# EAGLE design oldSHSDHDTD_system[1] (EAGLE 9.6.2)
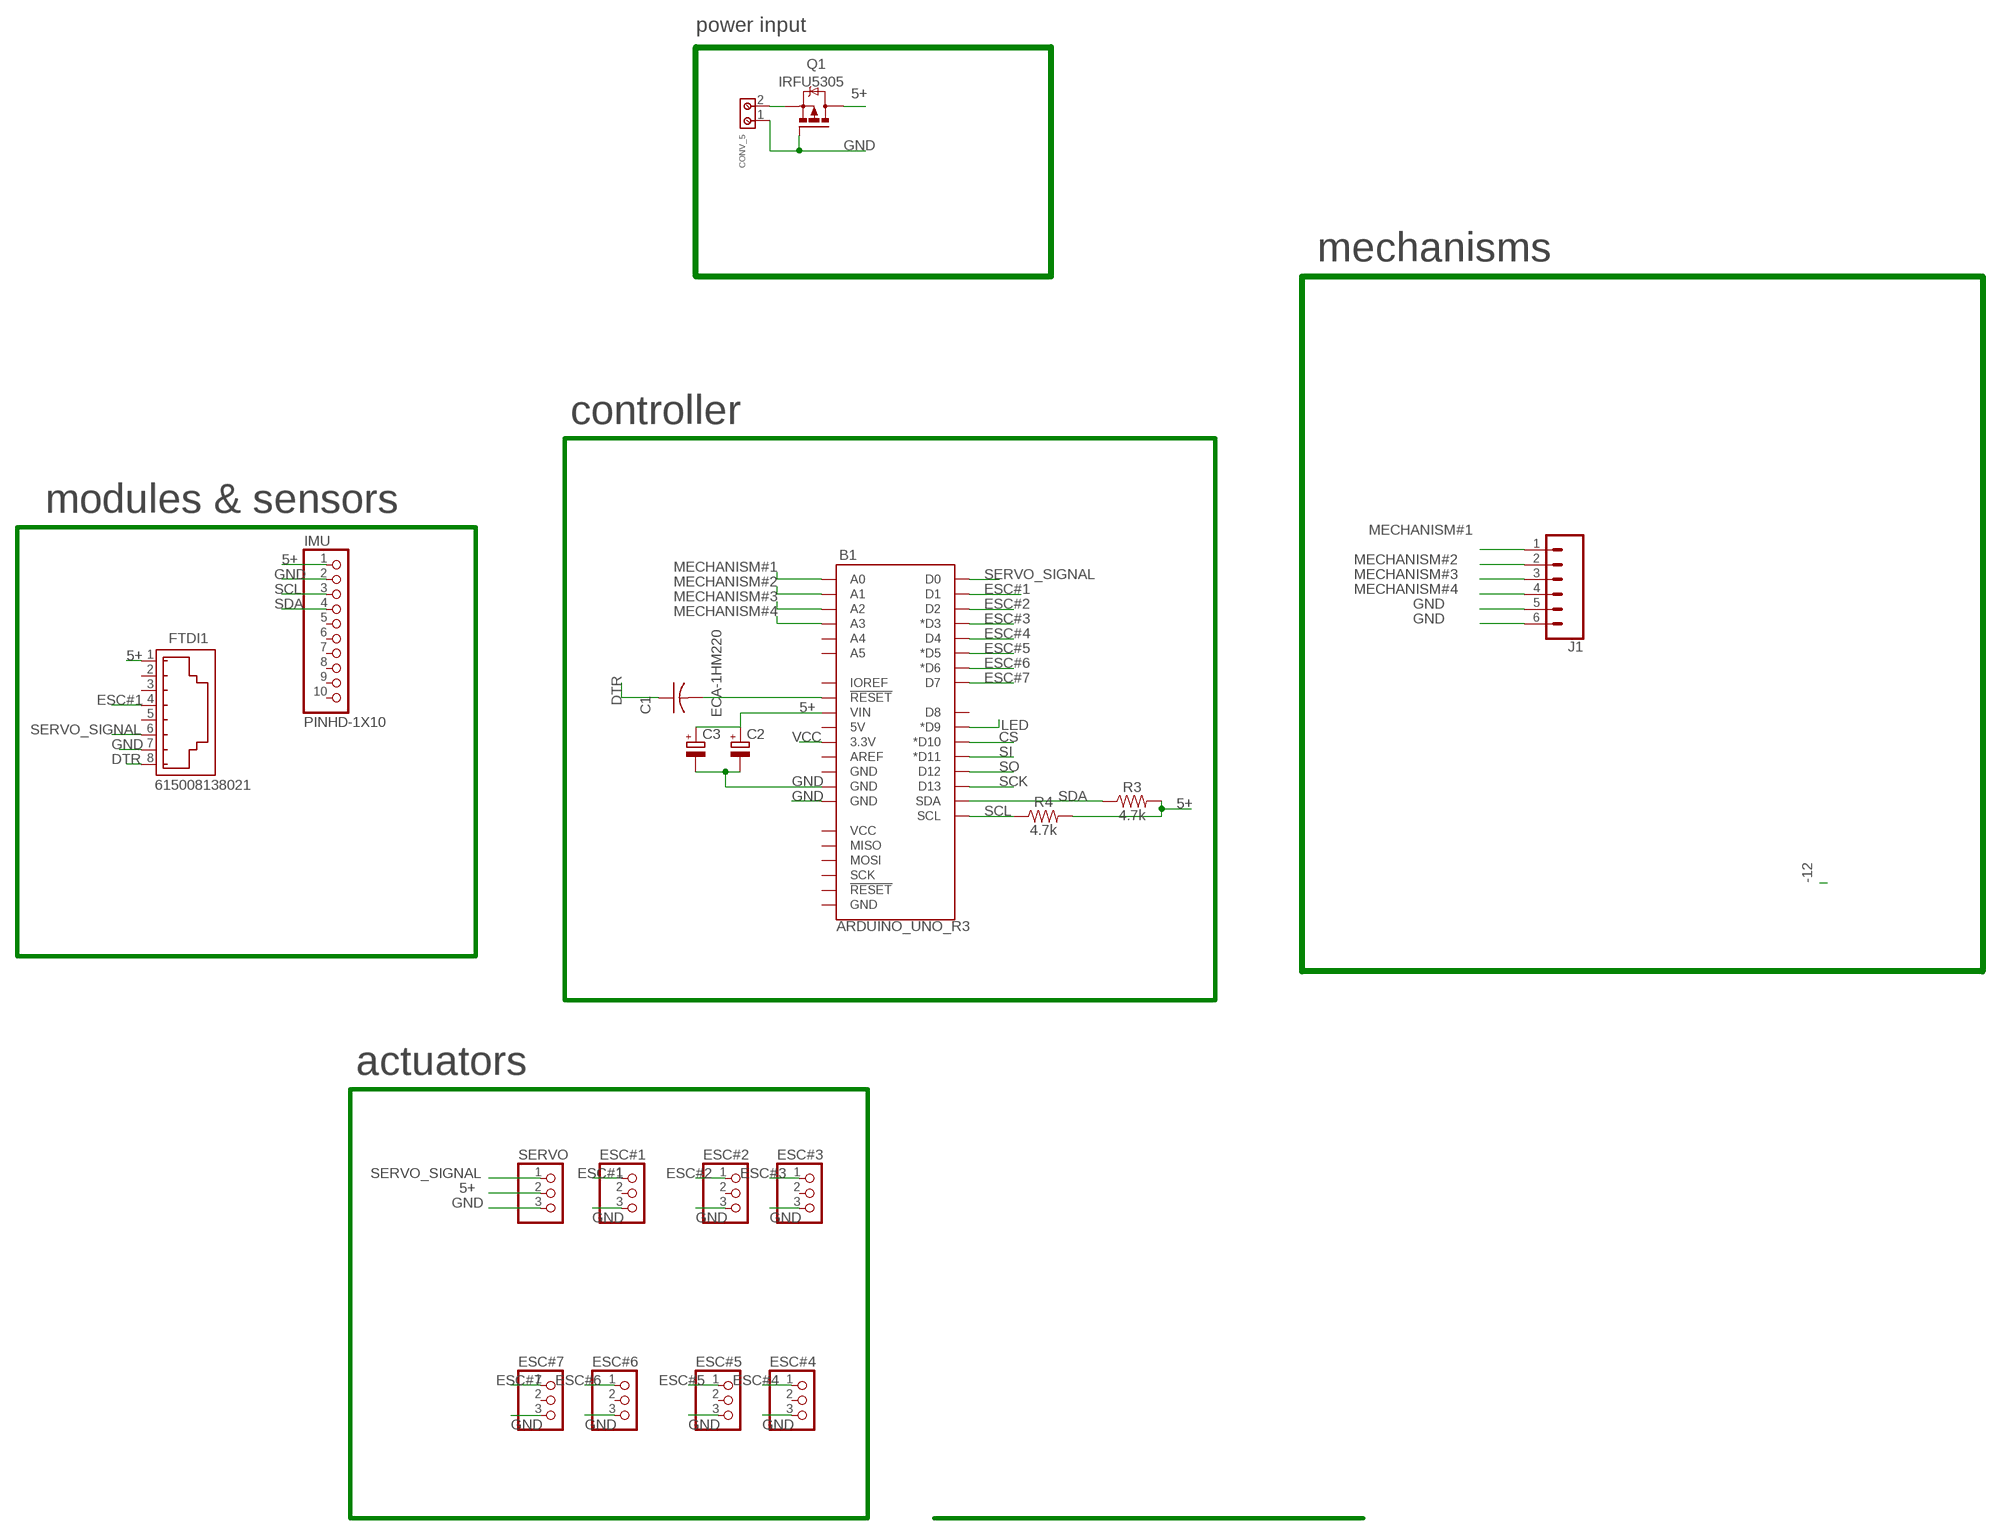
[diagram p0: schematic, sheet 1]

## Parts
B1  ARDUINO_UNO_R3  [ARDUINO_R3]
C1  ECA-1HM220  [CAP_RADIAL_2MM]
C2  CPOL-EUE7.5-16  [E7,5-16]
C3  CPOL-EUE7.5-16  [E7,5-16]
CONV_5  691213500002  [691213500002]
ESC#1  PINHD-1X3  [1X03]
ESC#2  PINHD-1X3  [1X03]
ESC#3  PINHD-1X3  [1X03]
ESC#4  PINHD-1X3  [1X03]
ESC#5  PINHD-1X3  [1X03]
ESC#6  PINHD-1X3  [1X03]
ESC#7  PINHD-1X3  [1X03]
FTDI1  615008138021  [615008138021]
IMU  PINHD-1X10  [1X10-BIG]
J1  CONN_06LOCK_LONGPADS  [1X06_LOCK_LONGPADS]
Q1  IRFU5305  [I-PAK_TO251AA]
R3  4.7k  10MOHM-HORIZ-1/4W-5%  [AXIAL-0.3]
R4  4.7k  10MOHM-HORIZ-1/4W-5%  [AXIAL-0.3]
SERVO  PINHD-1X3  [1X03]

## Nets
5+: B1.VIN C2.+ C3.+ FTDI1.1 IMU.1 Q1.2(D) R3.P$2 R4.P$2 SERVO.2
CS: B1.D10(*D10)
DTR: C1.1 FTDI1.8
ESC#1: B1.D1 ESC#1.1 FTDI1.4
ESC#2: B1.D2 ESC#2.1
ESC#3: B1.D3(*D3) ESC#3.1
ESC#4: B1.D4 ESC#4.1
ESC#5: B1.D5(*D5) ESC#5.1
ESC#6: B1.D6(*D6) ESC#6.1
ESC#7: B1.D7 ESC#7.1
GND: B1.GND@2(GND) B1.GND@3(GND) C2.- C3.- CONV_5.1 ESC#1.3 ESC#2.3 ESC#3.3 ESC#4.3 ESC#5.3 ESC#6.3 ESC#7.3 FTDI1.7 IMU.2 J1.5 J1.6 Q1.1(G) SERVO.3
LED: B1.D9(*D9)
MECHANISM#1: B1.A0 J1.1
MECHANISM#2: B1.A1 J1.2
MECHANISM#3: B1.A2 J1.3
MECHANISM#4: B1.A3 J1.4
N$2: B1.RESET@1(!RESET!) C1.2
N$3: CONV_5.2 Q1.3(S)
SCK: B1.D13
SCL: B1.SCL IMU.3 R4.P$1
SDA: B1.SDA IMU.4 R3.P$1
SERVO_SIGNAL: B1.D0 FTDI1.6 SERVO.1
SI: B1.D11(*D11)
SO: B1.D12
VCC: B1.3.3V
Unconnected: B1.5V B1.A4 B1.A5 B1.AREF B1.D8 B1.GND@1(GND) B1.GND@4(GND) B1.IOREF B1.MISO B1.MOSI B1.RESET@2(!RESET!) B1.SCK B1.VCC ESC#1.2 ESC#2.2 ESC#3.2 ESC#4.2 ESC#5.2 ESC#6.2 ESC#7.2 FTDI1.2 FTDI1.3 FTDI1.5 IMU.5 IMU.6 IMU.7 IMU.8 IMU.9 IMU.10

## Notes on the sheet
- power input
- mechanisms
- controller
- modules & sensors
- actuators

## Library data of the parts
B1 = SparkFun-Boards:ARDUINO_UNO_R3: Arduino R3 Footprint with SPI header Arduino Uno R3 Compatible Footprint. Matches PCB size of the original board. SparkFun Products: SAMD21 Dev Breakout <https://www.sparkfun.com/products/13672> RedBoard <https://www.sparkfun.com/products/12757> R3 Stackable Headers <https://www.sparkfun.com/products/11417>
C1 = Resistor_Capacitor:ECA-1HM220: CAP ALUM 22UF 20% 50V RADIAL Manufacturer's datasheet <https://media.digikey.com/pdf/Data%20Sheets/Panasonic%20Electronic%20Components/ECA-xxM%20Series,TypeA.pdf>; CREATED_BY: PCBLayout.com; DIGIKEY_PART_NUMBER: P5179-ND; MANUFACTURER: Panasonic Electronic Components; MPN: ECA-1HM220; PACKAGE: CAP RADIAL 2MM LS
C2 C3 = rcl:CPOL-EU: POLARIZED CAPACITOR, European symbol; SPICEPREFIX: C
CONV_5 = Wurth_Connectors_WR-TBL Rising Cage Clamp:691213500002: WR-TBL Serie 2135 - 5.08 mm Vertical Entry Modular w. Rising Cage Clamp KIND PROPERTIES Pitch 5.08 mm MATERIAL PROPERTIES Insulator Material PA66 Insulator Flammability Rating UL94 V-0 Contact Material Copper Alloy Contact Plating Tin over Nickel Terminal Screw Material Steel Terminal Screw Plating Zinc Wire Guard Material Copper Alloy GENERAL INFORMATION Operating Temperature -30 up to +120 °C Compliance RoHS ELECTRICAL PROPERTIES IR cULus 14 A IR VDE 14 A Working Voltage [cULus] 300 V (AC) Working Voltage [VDE] 250 V (AC) Withstanding Voltage [UL] 1600 V (AC) Withstanding Voltage [cULus] 1600 Withstanding Voltage [VDE] 2000 Contact Resistance [cULus] 20 mΩ Contact Resistance [VDE] 20 mΩ MECHANICAL PROPERTIES Wire Strip Length 6 Screw M3 CERTIFICATION cULus Approval E150931 VDE Approval 40021366 PACKAGING PROPERTIES Packaging Box <https://www.we-online.com/catalog/media/o58403v209%20Family_WR-TBL_5_08_2135_VERTICAL_CABLE_ENTRY_W_RISING_CLAMP_6912135000XX.jpg> Details see: https://www.we-online.com/catalog/en/TBL_5_08_2135_VERTICAL_CABLE_ENTRY_W_RISING_CLAMP_6912135000XX/ Updated by Ella Wu 2019-11-26 2019(C) Wurth Elektronik; IR-UL: 14A; IR-VDE: 14A; PART-NUMBER: 691213500002; PINS: 2; PITCH: 5.08mm; TYPE: Vertical; WIRE: 14 to 30 (AWG) 2.08 to 0.0509 (mm²); WORKING-VOLTAGE-UL: 300V (AC); WORKING-VOLTAGE-VDE: 250V (AC)
ESC#1-ESC#7 SERVO = adafruit:PINHD-1X3: PIN HEADER
FTDI1 = Wurth_Connectors_WR-MJ:615008138021: WR-MJ Modular Jack Vertical Plastic 8P8C Kind Properties Quality Class:500 Mating cycles MATERIAL PROPERTIES Insulator Material PA9T Insulator Flammability Rating UL94 V-0 Insulator Color Black Contact Material Copper Alloy Contact Plating 6u' on contact plating Contact Type Stamped GENERAL INFORMATION Operating Temperature -40 up to +85 °C ELECTRICAL PROPERTIES Working Voltage 125 V (AC) Contact Resistance 35 mΩ RISO 1000 MΩ PACKAGING PROPERTIES Packaging Tray <https://www.we-online.com/catalog/media/o33124v209%20Family_WR-MJ_615008138021.jpg> Details see: https://www.we-online.com/catalog/en/MJ_VERTICAL_PLASTIC_8P8C/ Updated by Yingchun,Shan 2020-01-07 2020(C) Wurth Elektronik; DATASHEET-URL: https://www.we-online.com/catalog/datasheet/615008138021.pdf; MOUNT: THT; PART-NUMBER: 615008138021; TYPE: Vertical; XPXC: 8P8C
IMU = adafruit:PINHD-1X10: Pin header 1x10 0.1" spacing With round pins
J1 = SparkFun-Connectors:CONN_06: Multi connection point. Often used as Generic Header-pin footprint for 0.1 inch spaced/style header connections On any of the 0.1 inch spaced packages, you can populate with these: Break Away Headers - Straight <https://www.sparkfun.com/products/116> (PRT-00116) Break Away Male Headers - Right Angle <https://www.sparkfun.com/products/553> (PRT-00553) Female Headers <https://www.sparkfun.com/products/115> (PRT-00115) Break Away Headers - Machine Pin <https://www.sparkfun.com/products/117> (PRT-00117) Break Away Female Headers - Swiss Machine Pin <https://www.sparkfun.com/products/743> (PRT-00743) Arduino Stackable Header - 6 Pin <https://www.sparkfun.com/products/9280> (PRT-09280) Screw Terminals 2.54mm Pitch (6-Pin) <https://www.sparkfun.com/products/16499> (PRT-16499) For SCREWTERMINALS and SPRING TERMINALS visit here: Screw Terimnals on SparkFun.com <https://www.sparkfun.com/search/results?term=Screw+Terminals> (5mm/3.5mm/2.54mm spacing) This device is also useful as a general connection point to wire up your design to another part of your project. Our various solder wires solder well into these plated through hole pads. Hook-Up Wire - Assortment (Stranded, 22 AWG) <https://www.sparkfun.com/products/11375> (PRT-11375) Hook-Up Wire - Assortment (Solid Core, 22 AWG) <https://www.sparkfun.com/products/11367> (PRT-11367) View the entire wire category on our website here <https://www.sparkfun.com/categories/141>
Q1 = transistor-power:IRF?5305: HEXFET Power MOSFET Source: http://www.irf.com/product-info/datasheets/data/irfr5305pbf.pdf
R3 R4 = SparkFun-Resistors:10MOHM: RES-09327; PROD_ID: RES-09327; VALUE: 10M

## Board
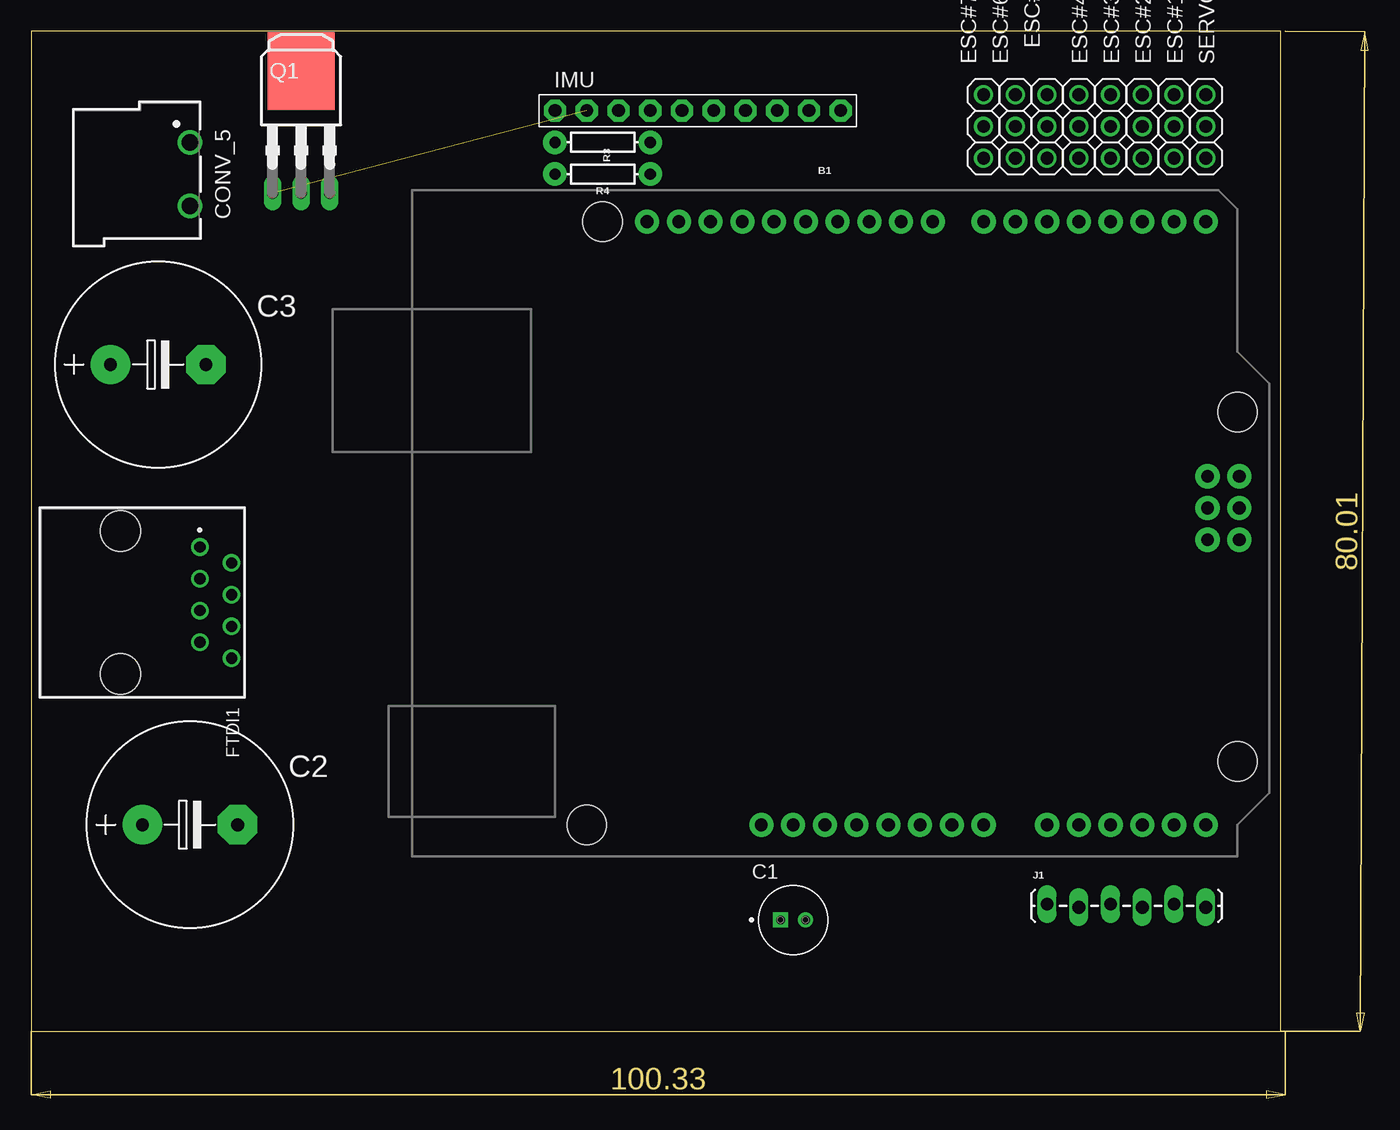
[diagram p1: board, top side]
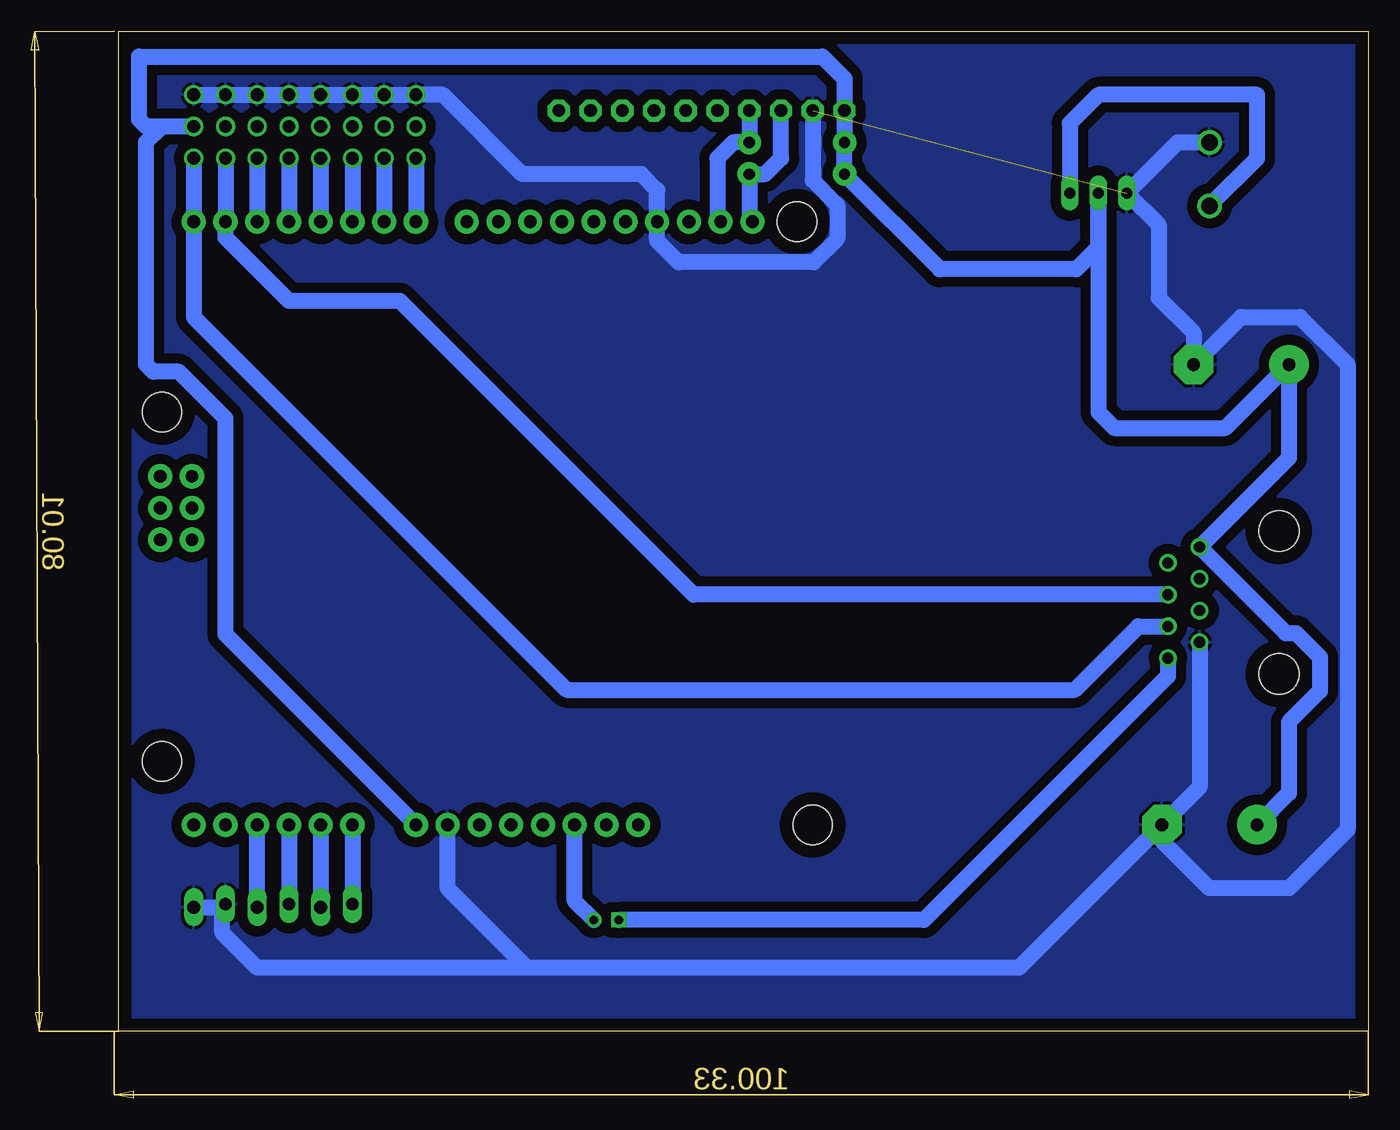
[diagram p2: board, bottom side, seen from below]

Size 100 x 80 mm. Coordinates in mm from the lower left corner, seen from the top.
Outline: 0,0 100,0 100,80 0,80 0,0
Copper layers (1*16): Top 0.035mm / dielectric 1.5mm / Bottom 0.035mm
Design rules "default *": minimum track width 0.4mm, minimum drill 0.35mm, track to track 0.4mm, track to pad 0.4mm, pad to pad 6mil, via to via 6mil, smd to smd 6mil, copper to edge 40mil, drill to drill 6mil, minimum pad ring 10mil, minimum via ring 8mil, stop-mask expansion 4mil, vias tented up to drill 0mil, thermal gap 10mil

### Footprints (pad centres in the part's own frame; a part is rotated, then mirrored left to right if it is on the bottom)
ARDUINO_R3 = drill 1.016 pad 1.93: 3.3V 2.54,-24.13; 5V 5.08,-24.13; A0 17.78,-24.13; A1 20.32,-24.13; A2 22.86,-24.13; A3 25.4,-24.13; A4 27.94,-24.13; A5 30.48,-24.13; AREF -9.144,24.13; D0 30.48,24.13; D1 27.94,24.13; D2 25.4,24.13; D3 22.86,24.13; D4 20.32,24.13; D5 17.78,24.13; D6 15.24,24.13; D7 12.7,24.13; D8 8.636,24.13; D9 6.096,24.13; D10 3.556,24.13; D11 1.016,24.13; D12 -1.524,24.13; D13 -4.064,24.13; GND@1 7.62,-24.13; GND@2 10.16,-24.13; GND@3 -6.604,24.13; GND@4 33.16,-1.32; IOREF -2.54,-24.13; MISO 30.62,3.76; MOSI 33.16,1.22; NC -5.08,-24.13; RESET@1 0,-24.13; RESET@2 30.62,-1.32; SCK 30.62,1.22; SCL -14.224,24.13; SDA -11.684,24.13; VCC 33.16,3.76; VIN 12.7,-24.13 | hole 3.175: -17.78,24.13; 33.02,8.89; 33.02,-19.05; -19.05,-24.13
CAP_RADIAL_2MM = drill 0.7 pad 1.1 square: 1 -1,0 | drill 0.7 pad 1.1: 2 1,0
E7,5-16 = drill 1.016 pad 3.15: + -3.81,0 | drill 1.016 pad 3.15 octagon: - 3.81,0
691213500002 = drill 1.3: 1 -2.54,0; 2 2.54,0
1X03 = drill 1.016: 1 -2.54,0; 2 0,0; 3 2.54,0
615008138021 = drill 0.9: 1 -4.445,4.6; 2 -3.175,7.14; 3 -1.905,4.6; 4 -0.635,7.14; 5 0.635,4.6; 6 1.905,7.14; 7 3.175,4.6; 8 4.445,7.14 | hole 3.25: -5.715,-1.75; 5.715,-1.75
1X10-BIG = drill 1.016 pad 1.778 octagon: 1 -11.43,0; 2 -8.89,0; 3 -6.35,0; 4 -3.81,0; 5 -1.27,0; 6 1.27,0; 7 3.81,0; 8 6.35,0; 9 8.89,0; 10 11.43,0
1X06_LOCK_LONGPADS = drill 1.016 long: 1 0,0; 2 2.54,-0.254; 3 5.08,0; 4 7.62,-0.254; 5 10.16,0; 6 12.7,-0.254
I-PAK_TO251AA = drill 0.889 long: 1 -2.286,-5.334; 2 0,-5.334; 3 2.286,-5.334 | smd 5.334 x 6.223: 4 0,4.445
AXIAL-0.3 = drill 0.9 pad 1.88: P$1 -3.81,0; P$2 3.81,0

### Placement (x,y rotation side)
B1  63.5,40.64 0 top
C1  60.96,8.89 0 top
C2  12.7,16.51 0 top
C3  10.16,53.34 0 top
CONV_5  12.7,68.58 270 top
ESC#1  91.44,72.39 90 top
ESC#2  88.9,72.39 90 top
ESC#3  86.36,72.39 90 top
ESC#4  83.82,72.39 90 top
ESC#5  81.28,72.39 90 top
ESC#6  78.74,72.39 90 top
ESC#7  76.2,72.39 90 top
FTDI1  8.89,34.29 270 top
IMU  53.34,73.66 0 top
J1  81.28,10.16 0 top
Q1  21.59,72.39 0 top
R3  45.72,71.12 180 top
R4  45.72,68.58 180 top
SERVO  93.98,72.39 90 top

### Tracks (layer width: path | path; a pad name or v marks a point on that pad's centre or on a via)
5+
  Bottom 1.27: C2.+ 6.35,19.05 6.35,24.73 3.86,27.22 3.86,29.93 5.78,31.85 6.61,31.85 FTDI1.1 6.35,45.88 C3.+ 11.43,48.26 20.32,48.26 21.59,49.53 Q1.2 21.63,67.02 21.63,62.69 23.36,60.96 34.29,60.96 R4.P$2 R3.P$2 IMU.1 41.91,76.2 43.69,77.98 98.35,77.98 98.35,72.95 97.79,72.39 SERVO.2 96.52,72.39 97.79,71.12 97.79,53.34 97.22,52.77 95.18,52.77 91.44,49.03 91.44,31.75 B1.VIN
DTR
  Bottom 1.27: FTDI1.8 16.03,28.42 35.56,8.89 C1.1
ESC#1
  Bottom 1.27: ESC#1.1 B1.D1 91.44,63.5 86.36,58.42 77.47,58.42 53.98,34.92 FTDI1.4
ESC#2
  Bottom 1.27: ESC#2.1 B1.D2
ESC#3
  Bottom 1.27: ESC#3.1 B1.D3
ESC#4
  Bottom 1.27: ESC#4.1 B1.D4
ESC#5
  Bottom 1.27: ESC#5.1 B1.D5
ESC#6
  Bottom 1.27: ESC#6.1 B1.D6
ESC#7
  Bottom 1.27: ESC#7.1 B1.D7
GND  (1 unrouted)
  Bottom 1.27: SERVO.3 ESC#1.3 ESC#2.3 ESC#3.3 ESC#4.3 ESC#5.3 ESC#6.3 ESC#7.3 74.04,74.93 67.69,68.58 58.17,68.58 56.9,67.31 B1.GND@3 56.9,63.25 55.18,61.53 44.38,61.53 42.48,63.43 42.48,66.11 44.45,68.08 IMU.2 | CONV_5.1 15.24,71.12 Q1.1 16.76,64.52 16.76,58.67 13.97,55.88 C3.- 10.16,57.15 5.46,57.15 1.65,53.34 1.65,16.13 6.35,11.43 12.7,11.43 16.51,15.24 C2.- | FTDI1.7 13.49,19.53 C2.- | C2.- 27.94,5.08 67.31,5.08 | 67.31,5.08 73.66,11.43 B1.GND@2 | J1.6 91.69,9.91 | 91.69,9.91 J1.5 | 67.31,5.08 88.9,5.08 91.69,7.87 91.69,9.91
  pour Bottom (isolate 0.813): 0,80.01 0,0 100.33,0 100.33,80.01
MECHANISM#1
  Bottom 1.27: B1.A0 J1.1
MECHANISM#2
  Bottom 1.27: B1.A1 J1.2
MECHANISM#3
  Bottom 1.27: B1.A2 J1.3
MECHANISM#4
  Bottom 1.27: J1.4 B1.A3
N$2
  Bottom 1.27: C1.2 63.5,10.43 B1.RESET@1
N$3
  Bottom 1.27: CONV_5.2 8.89,69.85 8.89,74.93 21.59,74.93 23.88,72.64 Q1.3
SCL
  Bottom 1.27: B1.SCL 49.53,65.02 R4.P$1 48.26,68.58 46.99,69.85 IMU.3
SDA
  Bottom 1.27: IMU.4 R3.P$1 50.8,71.12 52.07,69.85 52.07,65.02 B1.SDA
SERVO_SIGNAL
  Bottom 1.27: SERVO.1 B1.D0 93.98,57.15 64.14,27.3 23.5,27.3 18.41,32.38 FTDI1.6